# Altium project CurrentShuntAmp2.PrjPcb
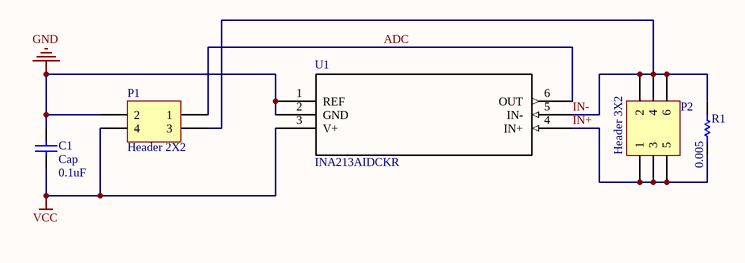
[diagram p0: CurrentShuntAmp2.SchDoc]
1 sheet, 5 parts. Net scope: global (net labels, ports and power ports of the same name join across sheets).
Board files: CurrentShuntAmp2a.PcbDoc, CurrentShuntAmp2c.PcbDoc, CurrentShuntAmp2b.PcbDoc

## Sheet CurrentShuntAmp2.SchDoc
size A4

### Parts
C1  Cap  value 0.1uF  [1608[0603]]
P1  Header 2X2  [HDR2X2]
P2  Header 3X2  [HDR2X3]
R1  value 0.005  [C1206]  (hidden comment: Res1)
U1  INA213AIDCKR  [DCK6]

### Nets
GND: C1.2 P1.2 U1.1(REF) U1.2(GND)
VCC: C1.1 P1.4 U1.3(V+)
ADC: P1.1 U1.6(OUT)
IN+: P2.1 P2.3 P2.5 R1.1 U1.4(IN+)
IN-: P1.3 P2.2 P2.4 P2.6 R1.2 U1.5(IN-)

### Library data of the parts
C1 = Cap Semi: Capacitor (Semiconductor SIM Model); Published: 8-Jun-2000; LatestRevisionDate: 29-May-2009; LatestRevisionNote: IPC-7351 Footprint Added.; PackageReference: C1206; Publisher: Altium Limited; PackageDescription: Chip Capacitor
P1 = Header 2X2: Header, 2-Pin, Dual row; LatestRevisionDate: 17-Jul-2002; LatestRevisionNote: Re-released for DXP Platform.; Publisher: Altium Limited
P2 = Header 3X2: Header, 3-Pin, Dual row; LatestRevisionDate: 17-Jul-2002; LatestRevisionNote: Re-released for DXP Platform.; Publisher: Altium Limited
R1 = Res1: Resistor; Published: 8-Jun-2000; LatestRevisionDate: 17-Jul-2002; LatestRevisionNote: Re-released for DXP Platform.; PackageReference: AXIAL-0.3; Publisher: Altium Limited; PackageDescription: Axial Device, Thru-Hole; 2 Leads; 0.3 in Pin Spacing
U1 = INA213AIDCKR: Imported; Manufacturer: Texas Instruments; GENERIC_PART_NUMBER: INA213A-Q1; Manufacturer_Part_Number: ina213a-q1_dck_6; INDUSTRY_STD_PKG_TYPE: SC70; FAMILY_NAME: CURRENT SHUNT MONITOR; PIN_COUNT: 6; PACKAGE_DESIGNATOR: DCK; Datasheet URL: http://www.ti.com/lit/gpn/INA213A-Q1; Vendor: Texas Instruments; RefDes: RefDes; Type: DEV; Value: Value